# EAGLE design ISOBUS_Hardware_S3 (EAGLE 9.6.2)
Assembly variants: Inline

## Sheet 1 of 5
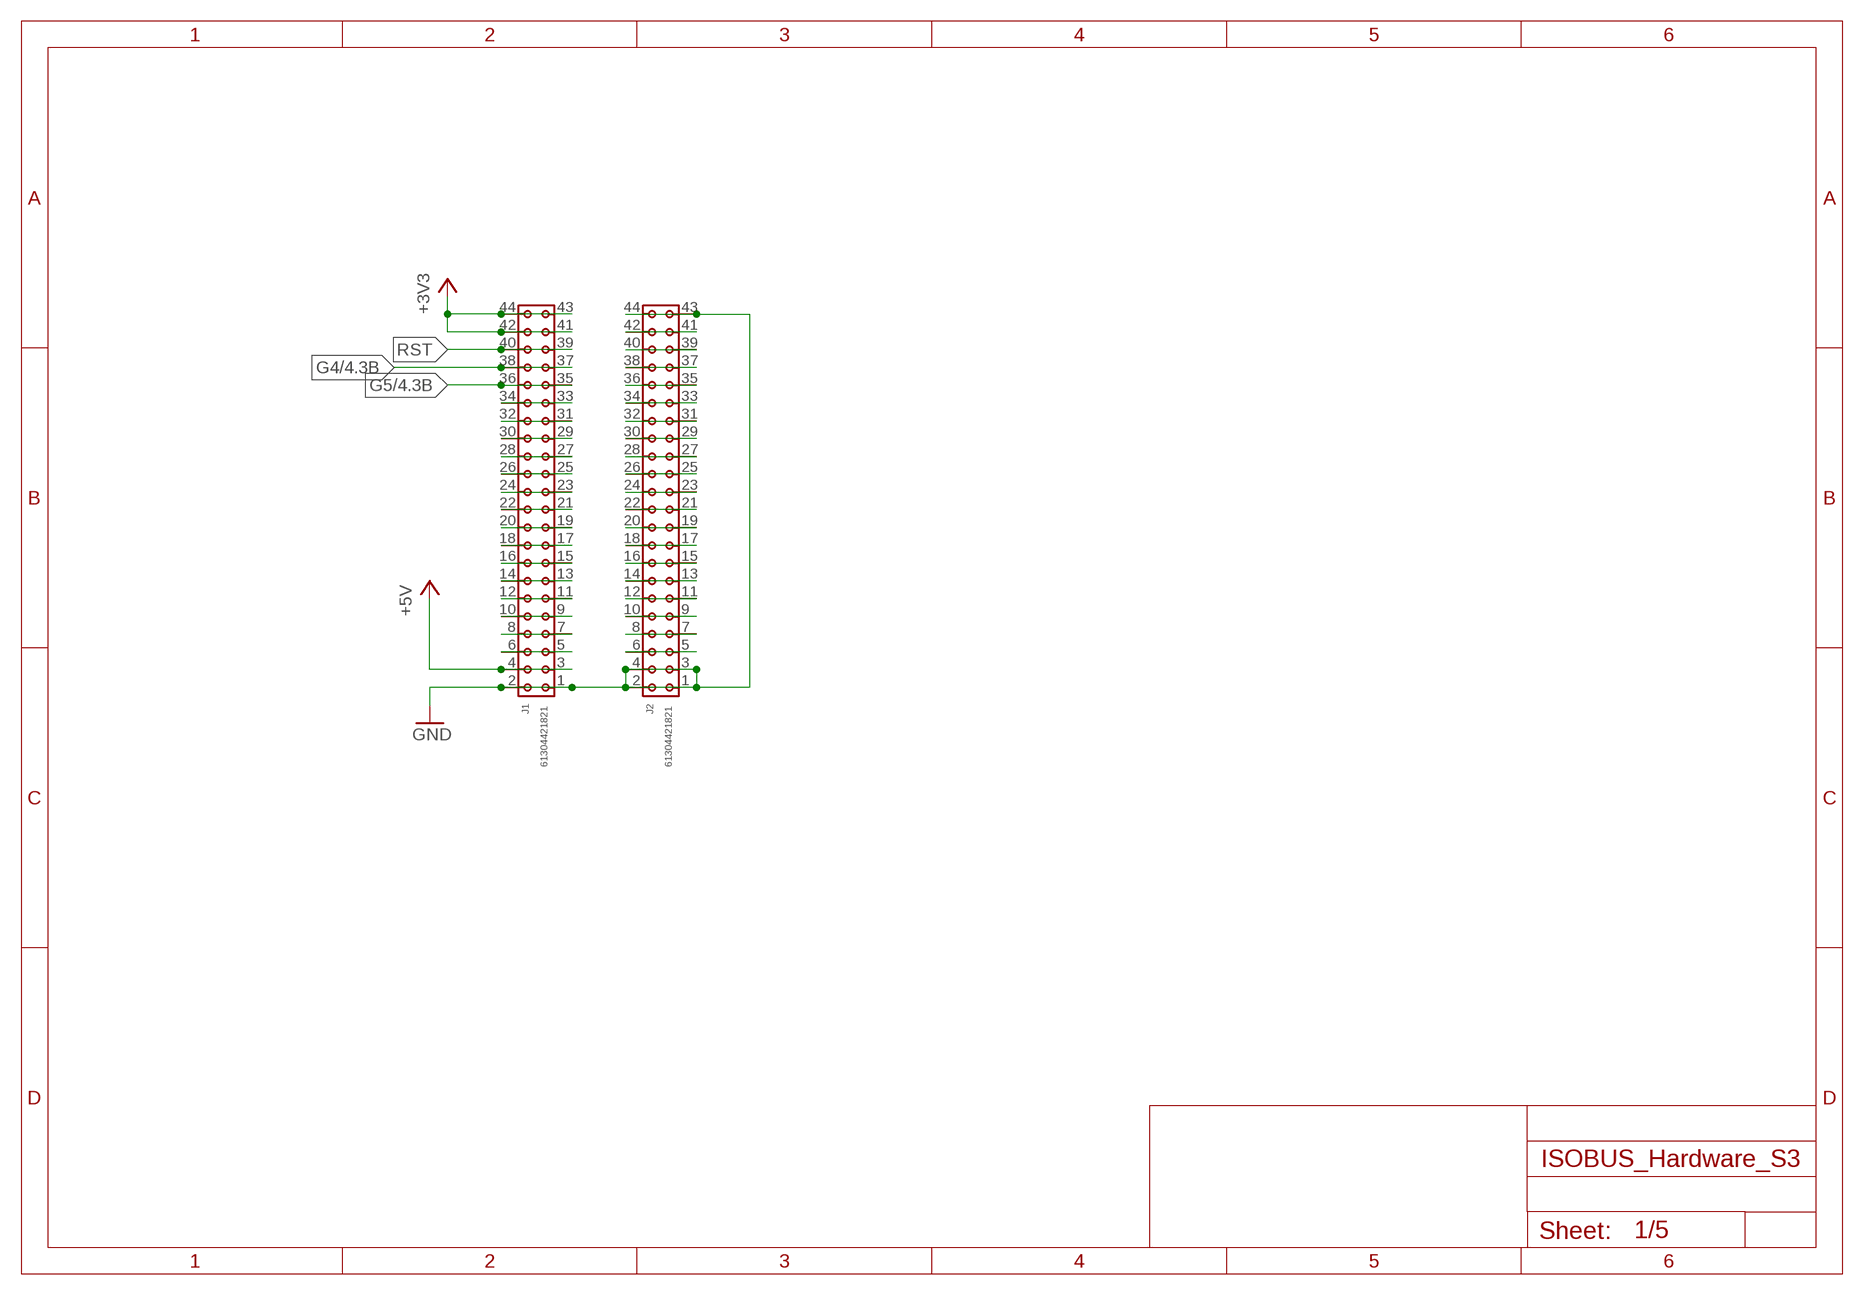
[diagram p0: schematic, sheet 1]

### Parts
J1  61304421821  6130XX21821_61304421821  [61304421821]
J2  61304421821  6130XX21821_61304421821  [61304421821]

### Nets
+3V3: J1.41 J1.42 J1.43 J1.44 ; also sheet 4
+5V: J1.3 J1.4 ; also sheet 4,5
G4: J1.37 J1.38 ; also sheet 4
G5: J1.35 J1.36 ; also sheet 4
GND: J1.1 J1.2 J2.1 J2.2 J2.3 J2.4 J2.43 J2.44 ; also sheet 2,3,4,5
N$3: J1.33 J1.34
N$4: J1.31 J1.32
N$5: J1.29 J1.30
N$6: J1.27 J1.28
N$7: J1.25 J1.26
N$8: J1.23 J1.24
N$9: J1.21 J1.22
N$10: J1.19 J1.20
N$11: J1.17 J1.18
N$12: J1.15 J1.16
N$13: J1.13 J1.14
N$14: J1.11 J1.12
N$15: J1.9 J1.10
N$16: J1.7 J1.8
N$17: J1.5 J1.6
N$18: J2.5 J2.6
N$19: J2.7 J2.8
N$20: J2.9 J2.10
N$21: J2.11 J2.12
N$22: J2.13 J2.14
N$23: J2.15 J2.16
N$24: J2.17 J2.18
N$25: J2.19 J2.20
N$26: J2.21 J2.22
N$27: J2.23 J2.24
N$28: J2.25 J2.26
N$29: J2.27 J2.28
N$30: J2.29 J2.30
N$31: J2.31 J2.32
N$32: J2.33 J2.34
N$33: J2.35 J2.36
N$34: J2.37 J2.38
N$35: J2.39 J2.40
N$36: J2.41 J2.42
RST: J1.39 J1.40

## Sheet 2 of 5
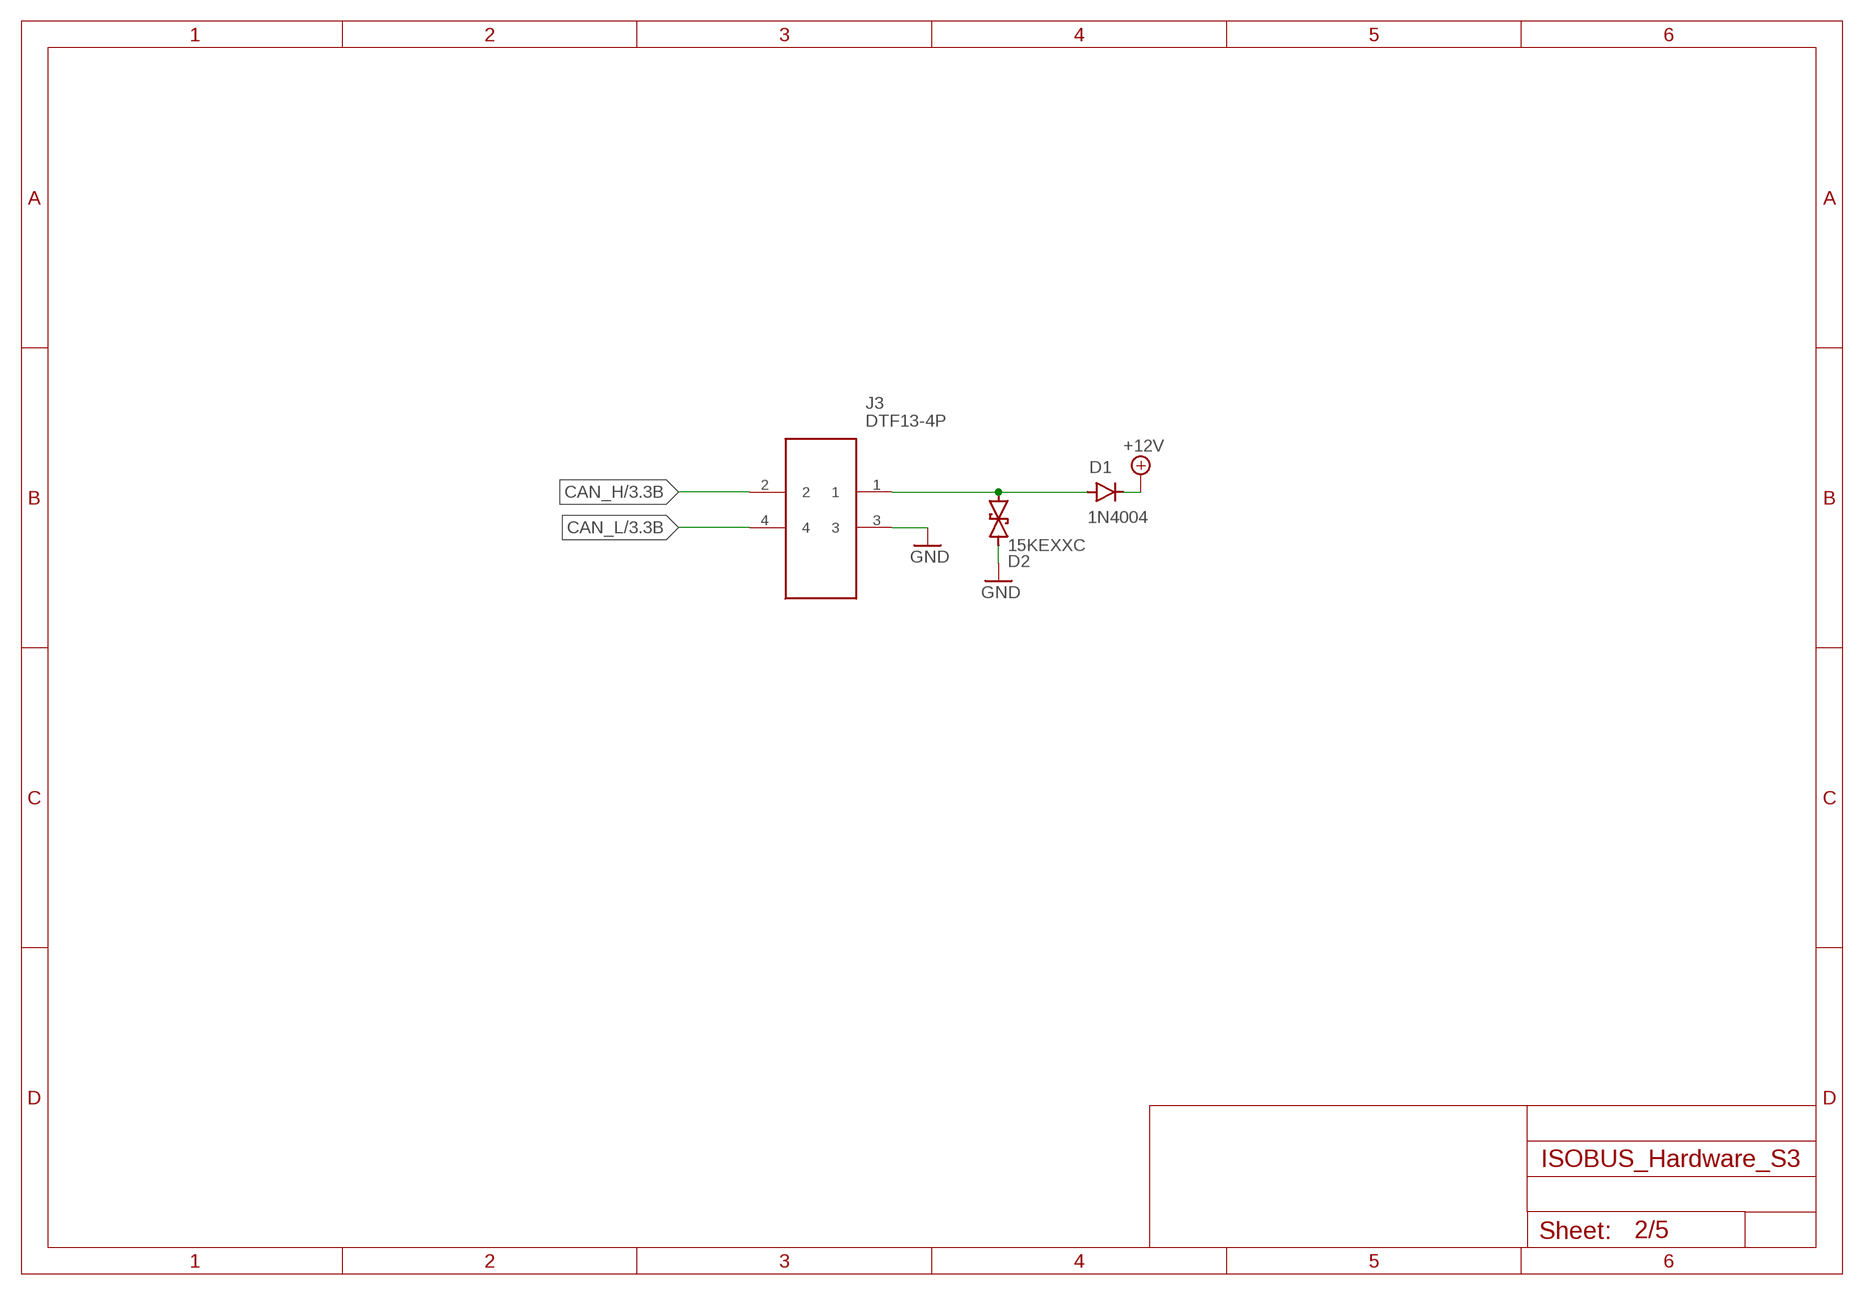
[diagram p1: schematic, sheet 2]

### Parts
D1  1N4004  [DO-41]
D2  15KEXXC  [CB429-17]
J3  DTF13-4P  [DTF134P]

### Nets
+12V: D1.C ; also sheet 5
CAN_H: J3.2 ; also sheet 3,4
CAN_L: J3.4 ; also sheet 3,4
GND: D2.A J3.3 ; also sheet 1,3,4,5
N$2: D1.A D2.C J3.1

## Sheet 3 of 5
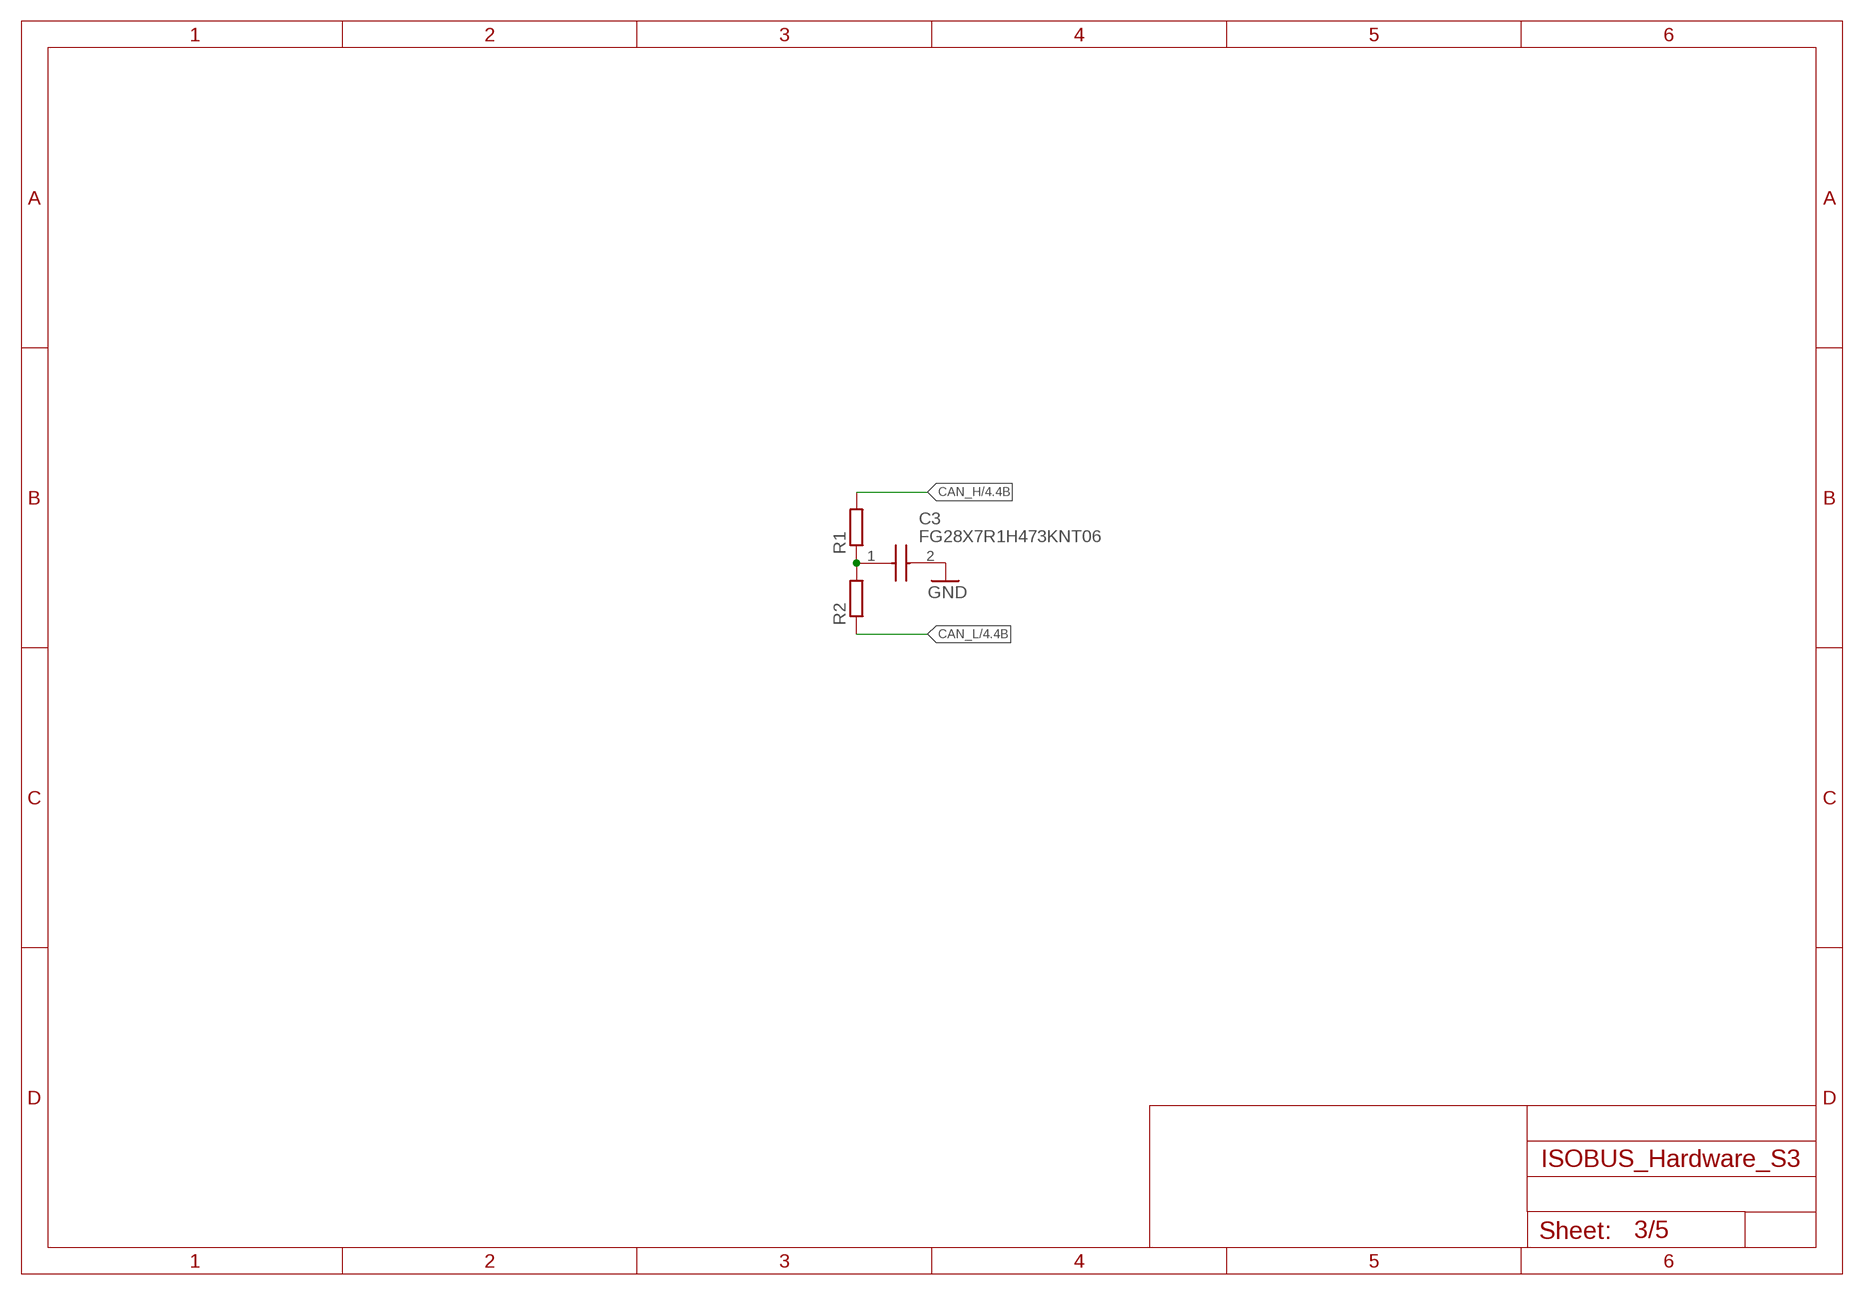
[diagram p2: schematic, sheet 3]

### Parts
C3  FG28X7R1H473KNT06  [FG28]
R1  R-EU_0204/7  [0204/7]
R2  R-EU_0204/7  [0204/7]

### Nets
CAN_H: R1.2 ; also sheet 2,4
CAN_L: R2.1 ; also sheet 2,4
GND: C3.2 ; also sheet 1,2,4,5
N$1: C3.1 R1.1 R2.2

## Sheet 4 of 5
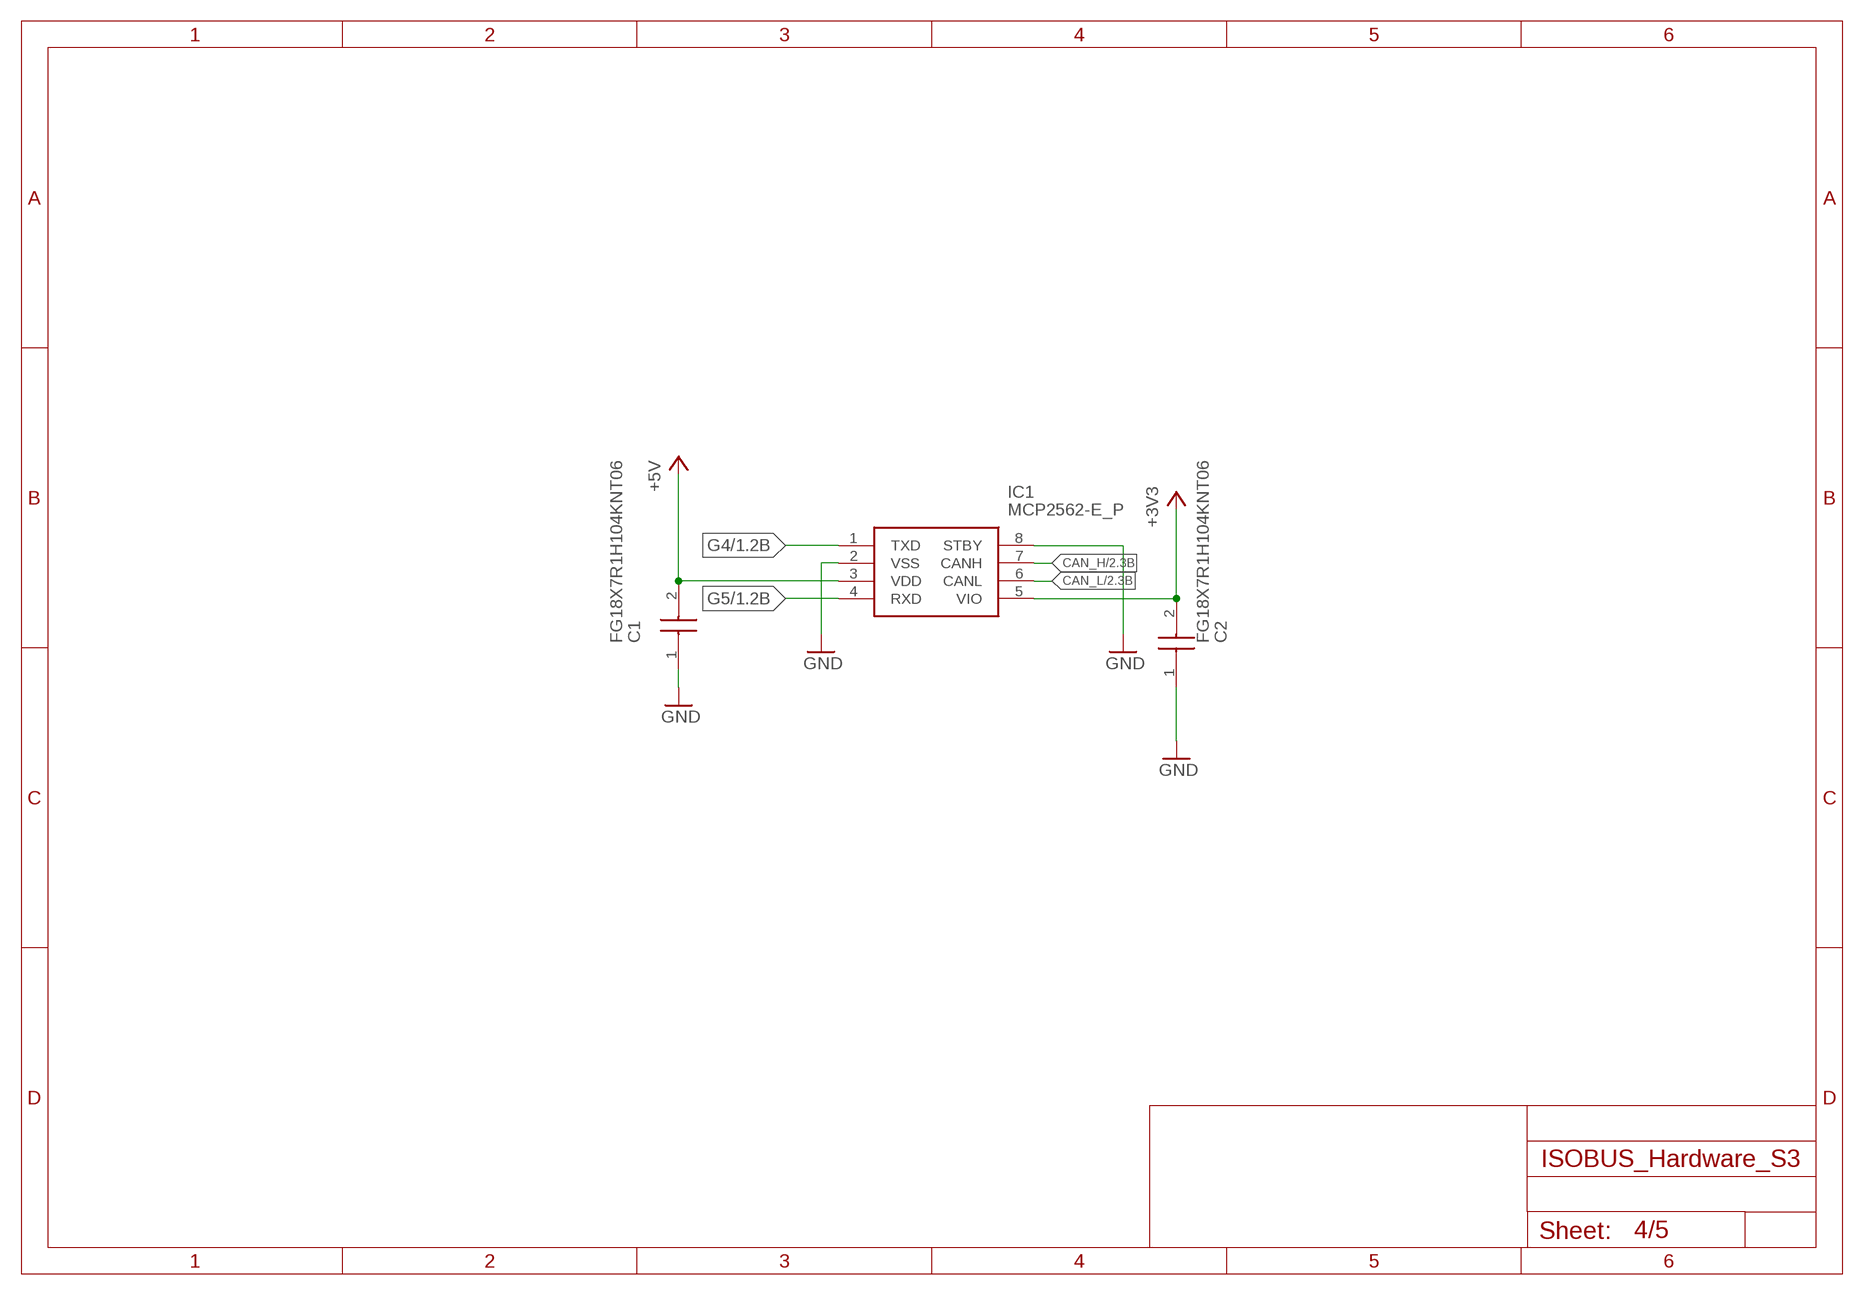
[diagram p3: schematic, sheet 4]

### Parts
C1  FG18X7R1H104KNT06  [FG18C0G1H101JNT06]
C2  FG18X7R1H104KNT06  [FG18C0G1H101JNT06]
IC1  MCP2562-E_P  [DIP781W56P254L950H533Q8N]

### Nets
+3V3: C2.2 IC1.5(VIO) ; also sheet 1
+5V: C1.2 IC1.3(VDD) ; also sheet 1,5
CAN_H: IC1.7(CANH) ; also sheet 2,3
CAN_L: IC1.6(CANL) ; also sheet 2,3
G4: IC1.1(TXD) ; also sheet 1
G5: IC1.4(RXD) ; also sheet 1
GND: C1.1 C2.1 IC1.2(VSS) IC1.8(STBY) ; also sheet 1,2,3,5

## Sheet 5 of 5
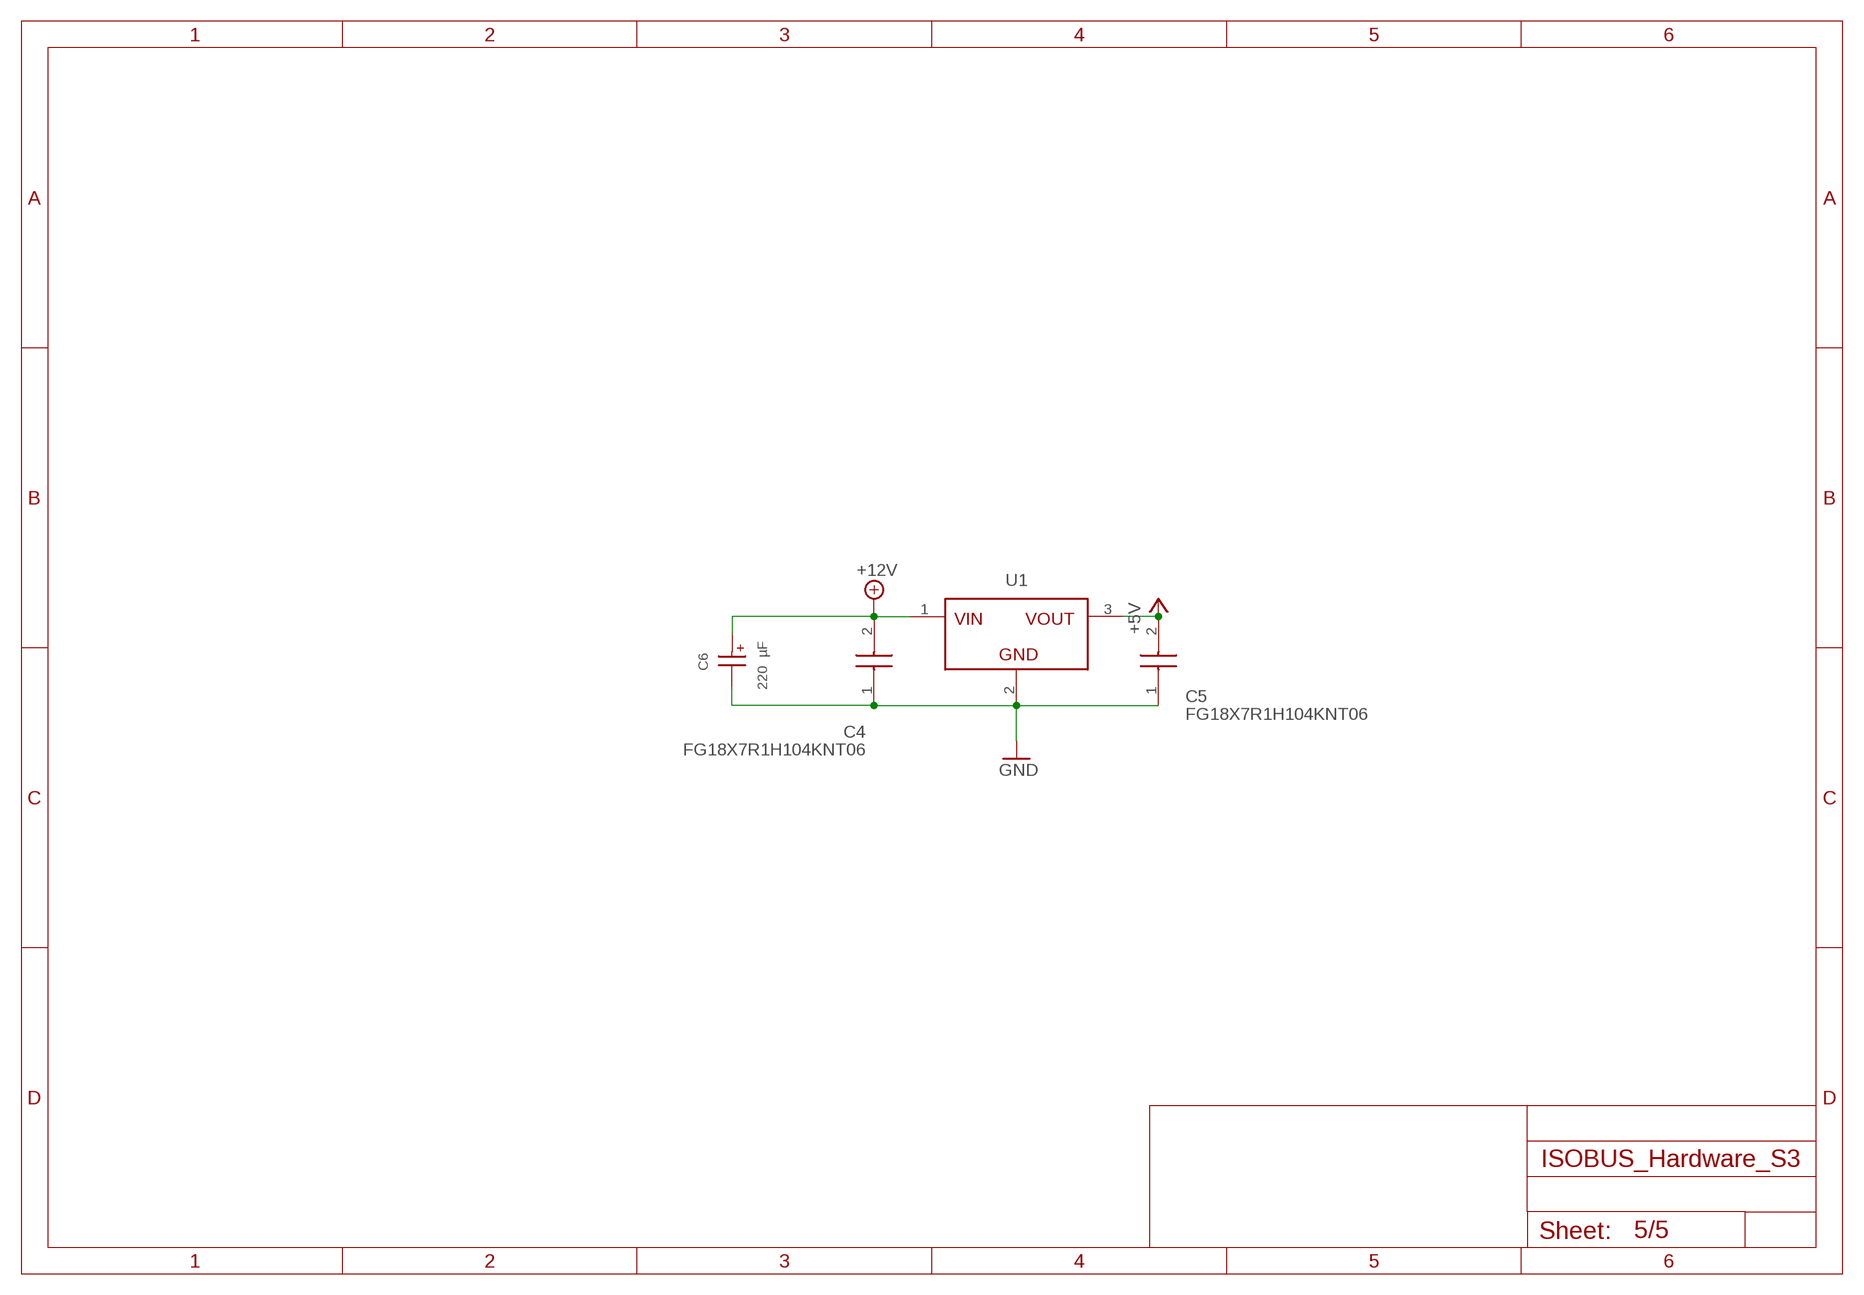
[diagram p4: schematic, sheet 5]

### Parts
C4  FG18X7R1H104KNT06  [FG18C0G1H101JNT06]
C5  FG18X7R1H104KNT06  [FG18C0G1H101JNT06]
C6  220 µF  WCAP-ATG8_6.3X11_860010373010  [WCAP-ATG8_6.3X11(DXL)]
U1  MAGI³C-FDSM_SIP-3_173010542_173XXXX42  [MAGI³C-FDSM_173XXXX42]

### Nets
+5V: C5.2 U1.3(VOUT) ; also sheet 1,4
+12V: C4.2 C6.1(+) U1.1(VIN) ; also sheet 2
GND: C4.1 C5.1 C6.2(-) U1.2(GND) ; also sheet 1,2,3,4

## Library data of the parts
C1 C2 C4 C5 = FG18X7R1H104KNT06-pcb-part-libraries:FG18X7R1H104KNT06: Multilayer Ceramic Capacitors MLCC - Leaded RAD 50V 0.1uF X7R 10% LS:2.5mm Source: Datasheet <https://product.tdk.com/en/system/files?file=dam/doc/product/capacitor/ceramic/lead-mlcc/catalog/leadmlcc_halogenfree_fg_en.pdf>; DESCRIPTION: Multilayer Ceramic Capacitors MLCC - Leaded RAD 50V 0.1uF X7R 10% LS:2.5mm; HEIGHT: 5.5mm; MANUFACTURER_NAME: TDK; MANUFACTURER_PART_NUMBER: FG18X7R1H104KNT06; MOUSER_PART_NUMBER: 810-FG18X7R1H104KNT6; MOUSER_PRICE-STOCK: https://www.mouser.co.uk/ProductDetail/TDK/FG18X7R1H104KNT06?qs=qf2ddTMq67WA8sH6FratLA%3D%3D
C3 = FG28X7R1H473KNT06-pcb-part-libraries:FG28X7R1H473KNT06: MLCC with dipped radial lead Source: Datasheet <https://componentsearchengine.com/Datasheets/1/FG28X7R1H473KNT06.pdf>; DESCRIPTION: MLCC with dipped radial lead; HEIGHT: 5.5mm; MANUFACTURER_NAME: TDK; MANUFACTURER_PART_NUMBER: FG28X7R1H473KNT06; MOUSER_PART_NUMBER: 810-FG28X7R1H473KNT6; MOUSER_PRICE-STOCK: https://www.mouser.com/Search/Refine.aspx?Keyword=810-FG28X7R1H473KNT6
C6 = Wurth_Capacitors_WCAP-ATG8:WCAP-ATG8_6.3X11: WCAP-ATG8 Aluminium Electrolytic Capacitors General Purpose +85 °C Characteristics General purpose product series with max. operating temperature of +85 °C Wide range of capacitance value Mounting style: THT Radial Capacitance range: 0.1 µF ‒ 33000 µF Capacitance tolerance: ±20 % Voltage range (UR): 10 ‒ 400 V(DC) Operating temperature: -40 °C up to +85 °C for UR < 400 V(DC) -25 °C up to +85 °C for UR ≥ 400 V(DC) Endurance: 2000 h @ +85 °C Dimensions (DxL) in mm: 5.0 x 11.0 up to 22.0 x 51.0 Recommended soldering: Wave soldering Applications Filtering Smoothing Energy storage Coupling <https://www.we-online.com/catalog/media/o35732v209%20WCAP-ATG8_4C.jpg> Details see: https://www.we-online.com/catalog/en/WCAP-ATG8/ Updated by yingchun,Shan;2020-02-27 2020(C) W��rth Elektronik; DATASHEET-URL: https://www.we-online.com/catalog/datasheet/860010373010.pdf; DF: 16%; DIAMETER: 6.3mm; I-LEAK: 35.2uA; I-RIPPLE: 308mA; L: 11mm; OPERATING-TEMPERATURE: -40 °C up to +85 °C; PART-NUMBER: 860010373010; PITCH: 2.5mm; TECHNICAL-REFERENCE: ATBD110221M016DSPA4B000; VR: 16V(DC)
D1 = Diodes:1N4004: DIODE GEN PURP 400V 1A DO41 Manufacturer's datasheet <https://www.mccsemi.com/pdf/Products/1N4001-1N4007(DO-41).pdf>; CREATED_BY: PCBLayout.com; DIGIKEY_PART_NUMBER: 1N4004MSCT-ND; MANUFACTURER: Micro Commercial Co; MPN: 1N4004; PACKAGE: DO-41
D2 = diode:15KEXXC: DIODE
IC1 = MCP2562-E_P-pcb-part-libraries:MCP2562-E_P: CAN Transceiver 1Mbps 5V 125degC PDIP8 Microchip MCP2562-E/P, CAN Transceiver 1-channel IEC 61000-4-2, 8-Pin PDIP Source: Datasheet <https://datasheet.datasheetarchive.com/originals/distributors/Datasheets-DGA14/1194231.pdf>; DESCRIPTION: CAN Transceiver 1Mbps 5V 125degC PDIP8 Microchip MCP2562-E/P, CAN Transceiver 1-channel IEC 61000-4-2, 8-Pin PDIP; HEIGHT: 5.334mm; MANUFACTURER_NAME: Microchip; MANUFACTURER_PART_NUMBER: MCP2562-E/P; MOUSER_PART_NUMBER: 579-MCP2562-E/P; MOUSER_PRICE-STOCK: https://www.mouser.co.uk/ProductDetail/Microchip-Technology/MCP2562-E-P?qs=6qKXPk0vzx1U%252B0h82Z%2Fybg%3D%3D
J1 J2 = Wurth_Connectors_WR-PHD:6130XX21821_61304421821: WR-PHD 2.54 mm Dual Socket Header ARTICLE PROPERTIES: Pins:4;​ 6;​ 8;​ 10;​ 12;​ 14;​ 16;​ 18;​ 20;​ 22;​ 24;​ 26;​ 28;​ 30;​ 32;​ 34;​ 36;​ 40;​ 44;​ 64;​ 72 KIND PROPERTIES: Pitch：2.54 mm Quality Class:3 as per CECC 75 301-802 Rows：Dual Gender：Socket Header Type：Straight MATERIAL PROPERTIES: Insulator Material :PBT Insulator Flammability Rating:UL94 V-0 Contact Material:Copper Alloy Contact Plating:Gold Contact Type:Stamped GENERAL INFORMATION Operating Temperature:-40 up to +125 °C Compliance:Lead free / RoHS ELECTRICAL PROPERTIES: Rated Current:3 A IR 1:3 A Withstanding Voltage:500 V (AC) Contact Resistance:20 mΩ RISO:1000 MΩ CERTIFICATION UL Approval:E323964 PACKAGING PROPERTIES Packaging:Tray <https://katalog.we-online.com/media/images/v2/o57948v209%20Family_Dual_Socket_Header_WR-PHD_6130xx21821.jpg> Details see: https://katalog.we-online.com/en/em/PHD_2_54_DUAL_SOCKET_HEADER_6130XX21821 Updated by Yingchun,Shan 2019-10-21 2019 (C) Würth Elektronik; DATASHEET-URL: https://www.we-online.com/catalog/datasheet/61304421821.pdf; GENDER: Socket Header; IR: 3A; MOUNT: THT; PACKAGING: Tray; PART-NUMBER: 61304421821; PINS: 44; PITCH: 2.54mm; ROWS: Dual; TYPE: Straight
J3 = DTF13-4P-pcb-part-libraries:DTF13-4P: Automotive Connectors 4P DTF RECP ASM 90 DEG. HEADER Source: Datasheet <https://www.te.com/commerce/DocumentDelivery/DDEController?Action=showdoc&DocId=Customer DrawingDTF13-4PApdfEnglishENG_CD_DTF13-4P_A.pdfDTF13-4P>; DESCRIPTION: Automotive Connectors 4P DTF RECP ASM 90 DEG. HEADER; HEIGHT: 20.22mm; MANUFACTURER_NAME: TE Connectivity; MANUFACTURER_PART_NUMBER: DTF13-4P; MOUSER_PART_NUMBER: 571-DTF13-4P; MOUSER_PRICE-STOCK: https://www.mouser.co.uk/ProductDetail/TE-Connectivity-DEUTSCH/DTF13-4P?qs=vkMqrgFpRaj6YYUKpv5OLg%3D%3D
R1 R2 = resistor:R-EU_: RESISTOR, European symbol
U1 = Wurth_Step Down Converter_MagI³C-FDSM:MAGI³C-FDSM_SIP-3: MagI³C-FDSM Fixed Step Down Regulator Module Characteristics Simplest design (no power supply knowledge required) Leaded through-hole package for easy manufacturing and prototyping Stand alone solution (CIN and COUT integrated, no external components) L78x series linear regulator replacement (no heatsink required) Low conducted and radiated EMI (compliant to EN55022 class B) Applications Point-of-Load from 24V, 18V, 15V, 12V, 9V rail Replacement for linear regulators Interface and microcontroller supply Industrial, Test & Measurement, Medical applications System power supplies <https://katalog.we-online.com/media/images/v2/o55808v209%20FDSM_MagI3C_173010378_4C.jpg> Details see: https://www.we-online.de/katalog/en/MAGIC_FDSM_FIXED_OUTPUT_VOLTAGE/ Updated by Ella Wu 2020-03-17 2020 (C) Würth Elektronik; DATASHEET-URL: https://www.we-online.de/katalog/datasheet/173010542.pdf; I-OUTPUT: 1A; MOUNT: THT; PART-NUMBER: 173010542; V-INPUT: 8-42V; V-OUTPUT: 5V

## Board
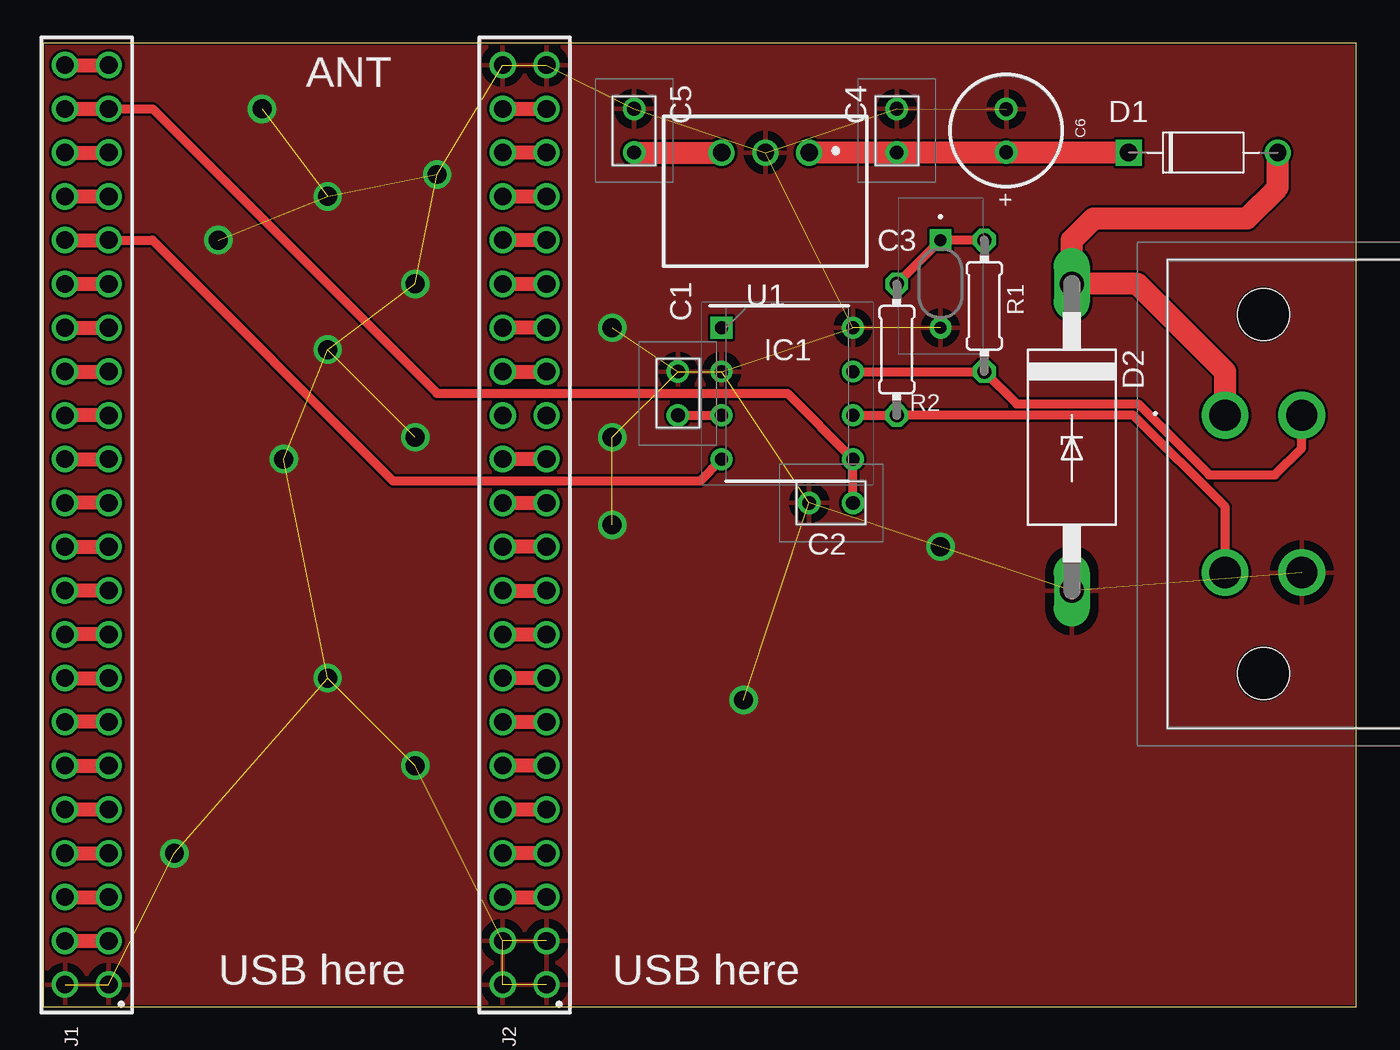
[diagram p5: board, top side]
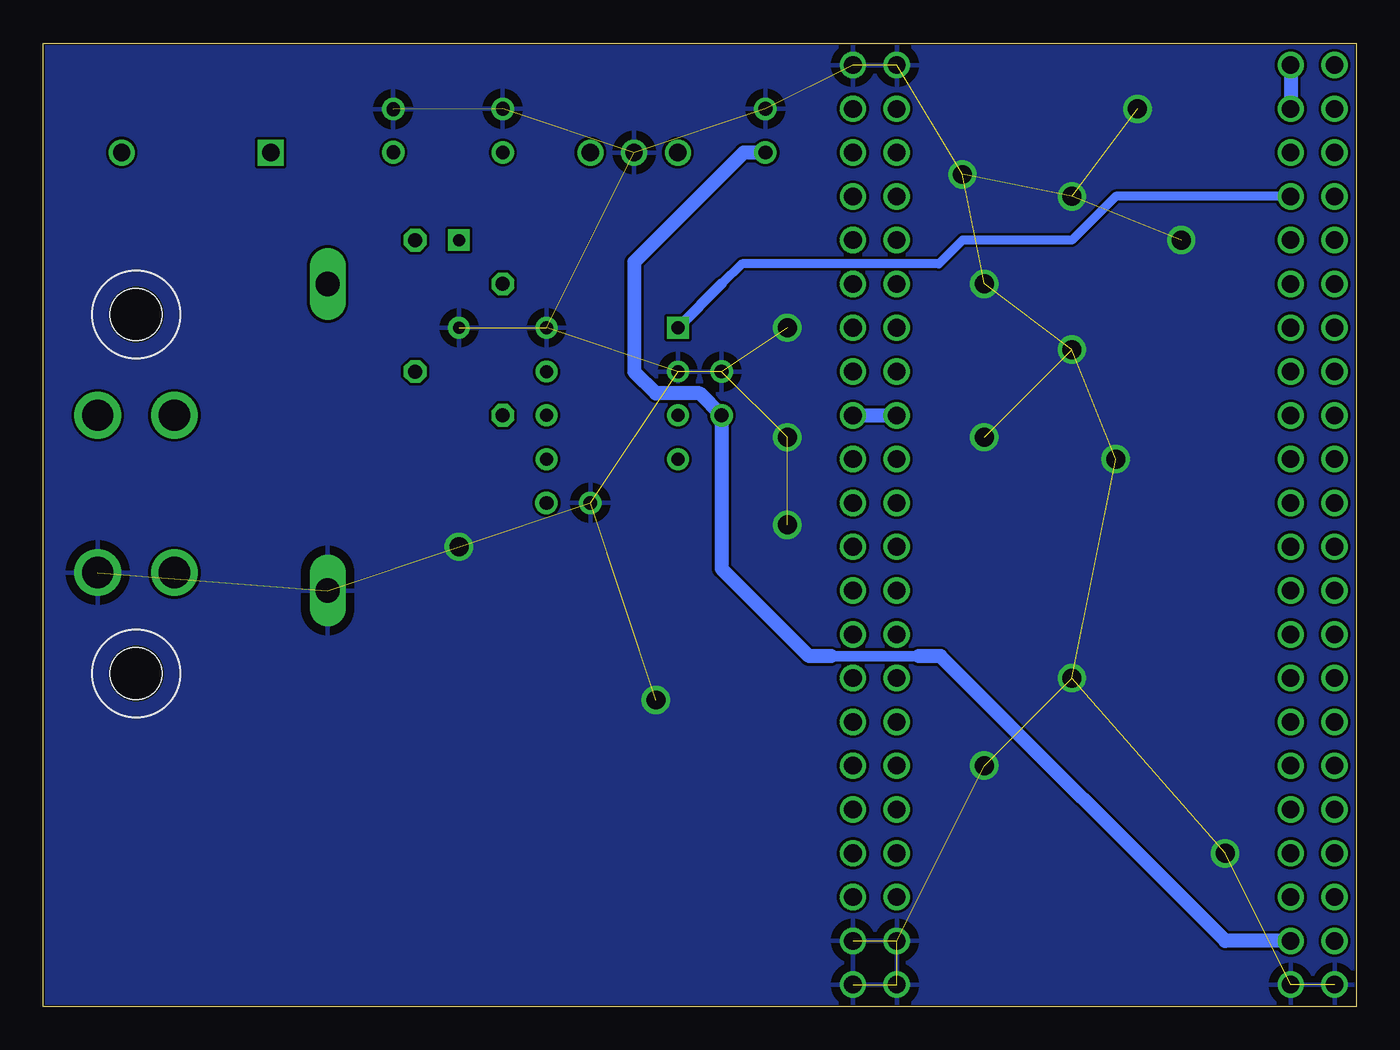
[diagram p6: board, bottom side, seen from below]

Size 76.2 x 55.88 mm. Coordinates in mm from the lower left corner, seen from the top.
Outline: 0,55.88 0,0 76.18,0 76.2,55.88 0,55.88
Copper layers (1*16): Top 0.035mm / dielectric 1.5mm / Bottom 0.035mm
Design rules "default *": minimum track width 6mil, minimum drill 0.35mm, track to track 6mil, track to pad 6mil, pad to pad 6mil, via to via 6mil, smd to smd 6mil, copper to edge 4mil, drill to drill 6mil, minimum pad ring 10mil, minimum via ring 8mil, stop-mask expansion 4mil, vias tented up to drill 0mil, thermal gap 20mil
Holes 3 mm at 70.81,19.31 70.81,40.14

### Footprints (pad centres in the part's own frame; a part is rotated, then mirrored left to right if it is on the bottom)
FG18C0G1H101JNT06 = drill 0.8 pad 1.3: 1 -1.27,0; 2 1.27,0
FG28 = drill 0.7 pad 1.25 square: 1 0,0 | drill 0.7 pad 1.25: 2 5.08,0
WCAP-ATG8_6.3X11(DXL) = drill 0.8: 1 1.25,0; 2 -1.25,0
DO-41 = drill 1: A 4.325,0 | drill 1 square: C -4.325,0
CB429-17 = drill 1.397 long: A 8.89,0; C -8.89,0
DIP781W56P254L950H533Q8N = drill 0.759 pad 1.159 square: 1 -3.81,3.81 | drill 0.759 pad 1.159: 2 -3.81,1.27; 3 -3.81,-1.27; 4 -3.81,-3.81; 5 3.81,-3.81; 6 3.81,-1.27; 7 3.81,1.27; 8 3.81,3.81
61304421821 = drill 1.02: 1 -26.67,-1.27; 2 -26.67,1.27; 3 -24.13,-1.27; 4 -24.13,1.27; 5 -21.59,-1.27; 6 -21.59,1.27; 7 -19.05,-1.27; 8 -19.05,1.27; 9 -16.51,-1.27; 10 -16.51,1.27; 11 -13.97,-1.27; 12 -13.97,1.27; 13 -11.43,-1.27; 14 -11.43,1.27; 15 -8.89,-1.27; 16 -8.89,1.27; 17 -6.35,-1.27; 18 -6.35,1.27; 19 -3.81,-1.27; 20 -3.81,1.27; 21 -1.27,-1.27; 22 -1.27,1.27; 23 1.27,-1.27; 24 1.27,1.27; 25 3.81,-1.27; 26 3.81,1.27; 27 6.35,-1.27; 28 6.35,1.27; 29 8.89,-1.27; 30 8.89,1.27; 31 11.43,-1.27; 32 11.43,1.27; 33 13.97,-1.27; 34 13.97,1.27; 35 16.51,-1.27; 36 16.51,1.27; 37 19.05,-1.27; 38 19.05,1.27; 39 21.59,-1.27; 40 21.59,1.27; 41 24.13,-1.27; 42 24.13,1.27; 43 26.67,-1.27; 44 26.67,1.27
DTF134P = drill 1.81 pad 2.715: 1 0,0; 2 -4.45,0; 3 -4.45,9.12; 4 0,9.12 | hole 3: -2.225,14.975; -2.225,-5.855
0204/7 = drill 0.813 octagon: 1 -3.81,0; 2 3.81,0
MAGI³C-FDSM_173XXXX42 = drill 1: 1 -2.54,0; 2 0,0; 3 2.54,0

### Placement (x,y rotation side)
C1  36.83,35.56 270 top
C2  45.72,29.21 0 top
C3  52.07,44.45 270 top
C4  49.53,50.8 270 top
C5  34.29,50.8 270 top
C6  55.88,50.8 270 top
D1  67.31,49.53 0 top
D2  59.69,33.02 270 top
IC1  43.18,35.56 0 top
J1  2.54,27.94 90 top
J2  27.94,27.94 90 top
J3  68.58,34.29 180 top
R1  54.61,40.64 270 top
R2  49.53,38.1 90 top
U1  41.91,49.53 180 top

### Tracks (layer width: path | path; a pad name or v marks a point on that pad's centre or on a via)
+3V3
  Top 0.508: C2.2 IC1.5 43.18,35.56 22.86,35.56 6.35,52.07 J1.41
  Top 0.813: J1.44 J1.43 | J1.42 J1.41
  Bottom 0.813: J1.43 J1.41
+5V
  Top 0.508: C1.2 IC1.3
  Top 0.813: J1.4 J1.3
  Top 1.27: C5.2 U1.3
  Bottom 0.61: 25.4,20.32 30.48,20.32
  Bottom 0.813: C5.2 35.56,49.53 41.91,43.18 41.91,36.83 40.64,35.56 38.1,35.56 C1.2 36.83,25.4 31.75,20.32 30.48,20.32 | J1.3 7.62,3.81 24.13,20.32 25.4,20.32
+12V
  Top 1.27: U1.1 C4.2 49.55,49.55 C6.1 62.96,49.55 D1.C
CAN_H
  Top 0.508: IC1.7 R1.2 56.49,34.95 63.54,34.95 67.66,30.83 71.47,30.83 73.03,32.39 J3.2
CAN_L
  Top 0.508: IC1.6 R2.1 63.27,34.29 68.58,28.98 J3.4
G4
  Top 0.813: J1.38 J1.37
  Bottom 0.508: 36.83,41.91 35.66,43.08 24.23,43.08 22.86,44.45 16.51,44.45 13.97,46.99 J1.37
  Bottom 0.61: 36.83,41.91 IC1.1
G5
  Top 0.508: IC1.4 38.1,30.48 20.32,30.48 6.35,44.45 J1.35
  Top 0.813: J1.36 J1.35
GND  (via drill 1.1)  (34 unrouted)
  other vias: 52.07,26.67 33.02,27.94 13.97,31.75 16.51,38.1 10.16,44.45 16.51,46.99 21.59,41.91 22.86,48.26 12.7,52.07 16.51,19.05 21.59,13.97 7.62,8.89 40.64,17.78 33.02,33.02 21.59,33.02 33.02,39.37
  pour Top: -1.27,57.15 78.74,57.15 78.74,-1.27 -1.27,-1.27
  pour Bottom: -1.27,57.15 78.74,57.15 78.74,-1.27 -1.27,-1.27
N$1
  Top 0.508: R1.1 C3.1 R2.2
N$2
  Top 1.27: J3.1 68.58,36.83 63.5,41.91 D2.C 59.69,44.45 60.96,45.72 69.85,45.72 71.64,47.5 D1.A
N$3
  Top 0.813: J1.34 J1.33
N$4
  Top 0.813: J1.32 J1.31
N$5
  Top 0.813: J1.30 J1.29
N$6
  Top 0.813: J1.27 J1.28
N$7
  Top 0.813: J1.26 J1.25
N$8
  Top 0.813: J1.23 J1.24
N$9
  Top 0.813: J1.22 J1.21
N$10
  Top 0.813: J1.19 J1.20
N$11
  Top 0.813: J1.17 J1.18
N$12
  Top 0.813: J1.16 J1.15
N$13
  Top 0.813: J1.13 J1.14
N$14
  Top 0.813: J1.12 J1.11
N$15
  Top 0.813: J1.10 J1.9
N$16
  Top 0.813: J1.8 J1.7
N$17
  Top 0.813: J1.6 J1.5
N$18
  Top 0.813: J2.6 J2.5
N$19
  Top 0.813: J2.7 J2.8
N$20
  Top 0.813: J2.10 J2.9
N$21
  Top 0.813: J2.11 J2.12
N$22
  Top 0.813: J2.14 J2.13
N$23
  Top 0.813: J2.15 J2.16
N$24
  Top 0.813: J2.18 J2.17
N$25
  Top 0.813: J2.20 J2.19
N$26
  Top 0.813: J2.21 J2.22
N$27
  Top 0.813: J2.24 J2.23
N$28
  Top 0.813: J2.25 J2.26
N$29
  Bottom 0.813: J2.27 J2.28
N$30
  Top 0.813: J2.30 J2.29
N$31
  Top 0.813: J2.31 J2.32
N$32
  Top 0.813: J2.34 J2.33
N$33
  Top 0.813: J2.35 J2.36
N$34
  Top 0.813: J2.38 J2.37
N$35
  Top 0.813: J2.39 J2.40
N$36
  Top 0.813: J2.42 J2.41
RST
  Top 0.813: J1.40 J1.39

### Text on the board
tPlace: ANT | USB here | USB here